# Altium schematic sheet [04] MICROCONTROLLER.SchDoc: Template
size A4; Author: Hom; CompanyName: KitSprout; DrawnBy: Hom; Engineer: Hom; Organization: KitSprout; Revision: A; SheetNumber: 4; SheetTotal: 7; Version: 0.0; LibVersion: 0.0
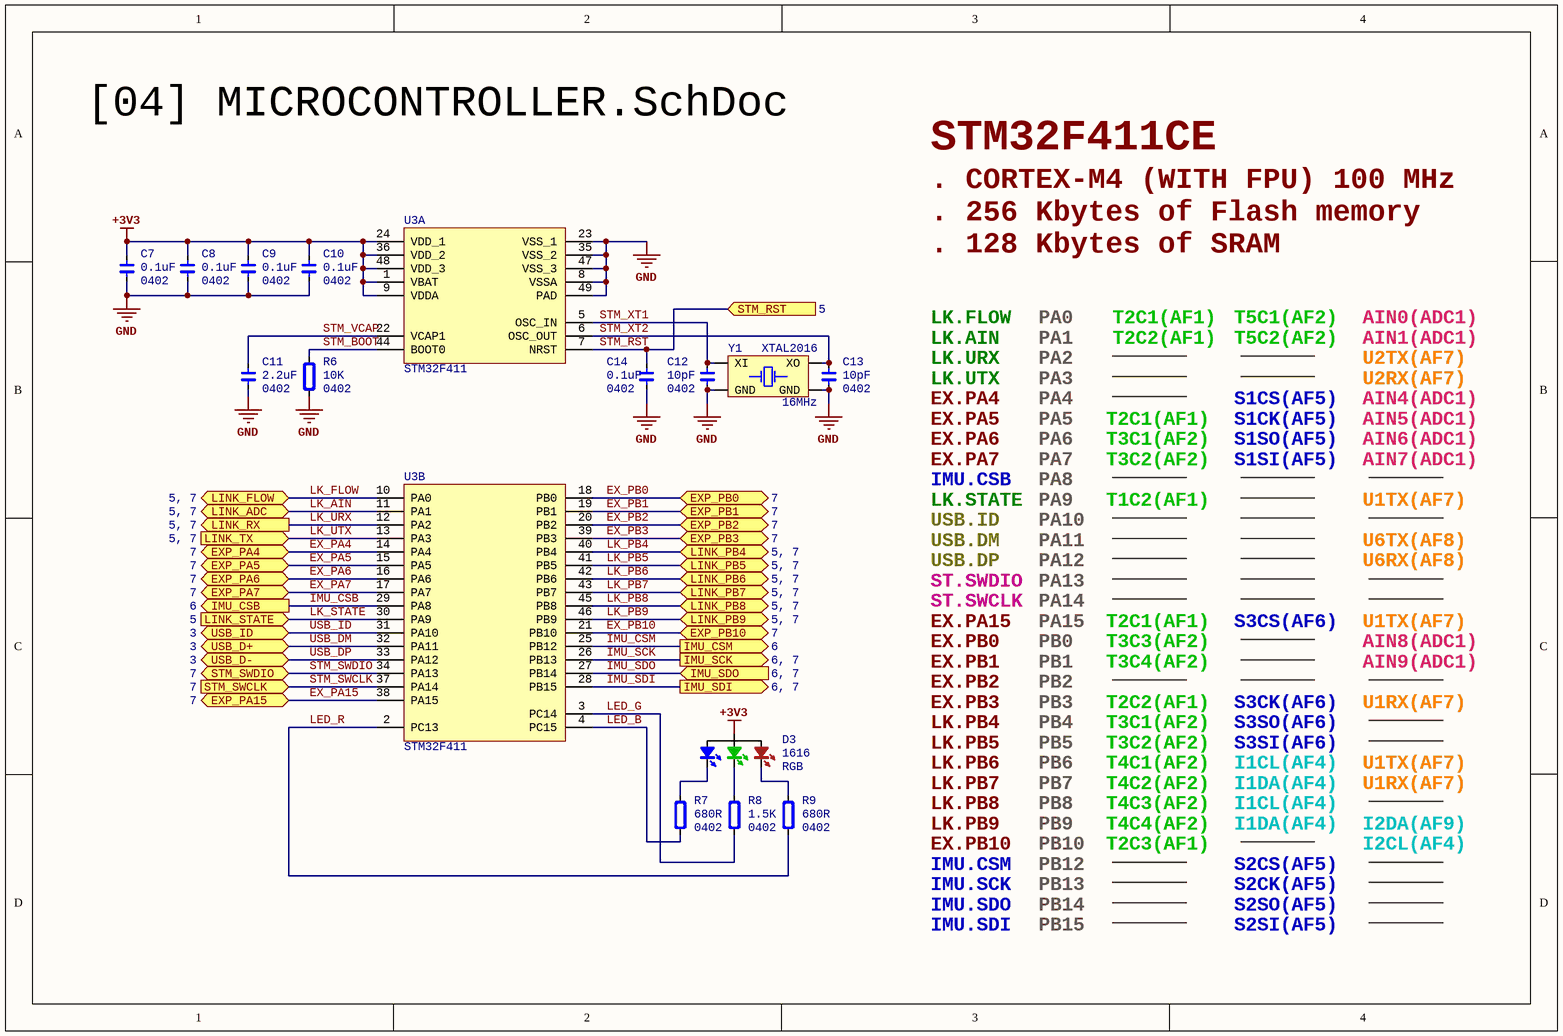
[diagram p0: [04] MICROCONTROLLER.SchDoc]

## Parts
C7  value 0.1uF  Type: 0402  [CAP_0402]  (hidden comment: C0402)
C8  value 0.1uF  Type: 0402  [CAP_0402]  (hidden comment: C0402)
C9  value 0.1uF  Type: 0402  [CAP_0402]  (hidden comment: C0402)
C10  value 0.1uF  Type: 0402  [CAP_0402]  (hidden comment: C0402)
C11  value 2.2uF  Type: 0402  [CAP_0402]  (hidden comment: C0402)
C12  value 10pF  Type: 0402  [CAP_0402]  (hidden comment: C0402)
C13  value 10pF  Type: 0402  [CAP_0402]  (hidden comment: C0402)
C14  value 0.1uF  Type: 0402  [CAP_0402]  (hidden comment: C0402)
D3  Type: 1616  [LED_1616_RGB]  (hidden comment: RGB)
R6  value 10K  Type: 0402  [RES_0402]  (hidden comment: R0402)
R7  value 680R  Type: 0402  [RES_0402]  (hidden comment: R0402)
R8  value 1.5K  Type: 0402  [RES_0402]  (hidden comment: R0402)
R9  value 680R  Type: 0402  [RES_0402]  (hidden comment: R0402)
U3  STM32F411  [QFN_P0.5_48]  (parts A,B of 2)
Y1  value 16MHz  [XT_2016_4]  (hidden comment: XTAL2016)

## Ports
EXP_PA4 (bidir, see 7), EXP_PA5 (bidir, see 7), EXP_PA6 (bidir, see 7), EXP_PA7 (bidir, see 7), EXP_PA15 (bidir, see 7), EXP_PB0 (bidir, see 7), EXP_PB1 (bidir, see 7), EXP_PB2 (bidir, see 7), EXP_PB3 (bidir, see 7), EXP_PB10 (bidir, see 7), IMU_CSB (out, see 6), IMU_CSM (out, see 6), IMU_SCK (out, see 6, 7), IMU_SDI (out, see 6, 7), IMU_SDO (in, see 6, 7), LINK_ADC (bidir, see 5, 7), LINK_FLOW (bidir, see 5, 7), LINK_PB4 (bidir, see 5, 7), LINK_PB5 (bidir, see 5, 7), LINK_PB6 (bidir, see 5, 7), LINK_PB7 (bidir, see 5, 7), LINK_PB8 (bidir, see 5, 7), LINK_PB9 (bidir, see 5, 7), LINK_RX (out, see 5, 7), LINK_STATE (in, see 5), LINK_TX (in, see 5, 7), STM_RST (in, see 5), STM_SWCLK (in, see 7), STM_SWDIO (bidir, see 7), USB_D+ (bidir, see 3), USB_D- (bidir, see 3), USB_ID (bidir, see 3)

## Nets
+3V3: C7.2 C8.2 C9.2 C10.2 D3.4(A) U3.1(VBAT) U3.9(VDDA) U3.24(VDD_1) U3.36(VDD_2) U3.48(VDD_3)
GND: C7.1 C8.1 C9.1 C10.1 C11.1 C12.1 C13.1 C14.1 R6.1 U3.8(VSSA) U3.23(VSS_1) U3.35(VSS_2) U3.47(VSS_3) U3.49(PAD) Y1.2(GND) Y1.4(GND)
EX_PA4: U3.14(PA4) ; port EXP_PA4
EX_PA5: U3.15(PA5) ; port EXP_PA5
EX_PA6: U3.16(PA6) ; port EXP_PA6
EX_PA7: U3.17(PA7) ; port EXP_PA7
EX_PA15: U3.38(PA15) ; port EXP_PA15
EX_PB0: U3.18(PB0) ; port EXP_PB0
EX_PB1: U3.19(PB1) ; port EXP_PB1
EX_PB2: U3.20(PB2) ; port EXP_PB2
EX_PB3: U3.39(PB3) ; port EXP_PB3
EX_PB10: U3.21(PB10) ; port EXP_PB10
IMU_CSB: U3.29(PA8) ; port IMU_CSB
IMU_CSM: U3.25(PB12) ; port IMU_CSM
IMU_SCK: U3.26(PB13) ; port IMU_SCK
IMU_SDI: U3.28(PB15) ; port IMU_SDI
IMU_SDO: U3.27(PB14) ; port IMU_SDO
LED_B: R7.1 U3.4(PC15)
LED_G: R8.1 U3.3(PC14)
LED_R: R9.1 U3.2(PC13)
LK_AIN: U3.11(PA1) ; port LINK_ADC
LK_FLOW: U3.10(PA0) ; port LINK_FLOW
LK_PB4: U3.40(PB4) ; port LINK_PB4
LK_PB5: U3.41(PB5) ; port LINK_PB5
LK_PB6: U3.42(PB6) ; port LINK_PB6
LK_PB7: U3.43(PB7) ; port LINK_PB7
LK_PB8: U3.45(PB8) ; port LINK_PB8
LK_PB9: U3.46(PB9) ; port LINK_PB9
LK_STATE: U3.30(PA9) ; port LINK_STATE
LK_URX: U3.12(PA2) ; port LINK_RX
LK_UTX: U3.13(PA3) ; port LINK_TX
STM_BOOT: R6.2 U3.44(BOOT0)
STM_RST: C14.2 U3.7(NRST) ; port STM_RST
STM_SWCLK: U3.37(PA14) ; port STM_SWCLK
STM_SWDIO: U3.34(PA13) ; port STM_SWDIO
STM_VCAP: C11.2 U3.22(VCAP1)
STM_XT1: C12.2 U3.5(OSC_IN) Y1.1(XI)
STM_XT2: C13.2 U3.6(OSC_OUT) Y1.3(XO)
USB_DM: U3.32(PA11) ; port USB_D+
USB_DP: U3.33(PA12) ; port USB_D-
USB_ID: U3.31(PA10) ; port USB_ID
NetD3_1: D3.1(R) R9.2
NetD3_2: D3.2(G) R8.2
NetD3_3: D3.3(B) R7.2

## Notes on the sheet
- STM32F411CE
- . CORTEX-M4 (WITH FPU) 100 MHz
  . 256 Kbytes of Flash memory
  . 128 Kbytes of SRAM
- LK.FLOW
- LK.AIN
- LK.URX
- LK.UTX
- PA0
- PA1
- PA2
- PA3
- T2C1(AF1)
- T2C2(AF1)
- T5C1(AF2)
- T5C2(AF2)
- AIN0(ADC1)
- AIN1(ADC1)
- U2TX(AF7)
- U2RX(AF7)
- EX.PA4
- EX.PA5
- EX.PA6
- PA4
- PA5
- PA6
- T3C1(AF2)
- S1CS(AF5)
- S1CK(AF5)
- S1SO(AF5)
- AIN4(ADC1)
- AIN5(ADC1)
- AIN6(ADC1)
- EX.PA7
- IMU.CSB
- LK.STATE
- PA7
- PA8
- PA9
- T3C2(AF2)
- T1C2(AF1)
- S1SI(AF5)
- AIN7(ADC1)
- U1TX(AF7)
- USB.ID
- USB.DM
- USB.DP
- PA10
- PA11
- PA12
- U6TX(AF8)
- U6RX(AF8)
- EX.PA15
- EX.PB0
- ST.SWDIO
- ST.SWCLK
- PA15
- PB0
- PA13
- PA14
- T3C3(AF2)
- S3CS(AF6)
- AIN8(ADC1)
- EX.PB1
- EX.PB3
- EX.PB2
- PB1
- PB3
- PB2
- T3C4(AF2)
- S3CK(AF6)
- AIN9(ADC1)
- U1RX(AF7)
- LK.PB4
- LK.PB5
- LK.PB6
- LK.PB7
- PB4
- PB5
- PB6
- PB7
- T4C1(AF2)
- T4C2(AF2)
- I1CL(AF4)
- I1DA(AF4)
- S3SO(AF6)
- S3SI(AF6)
- LK.PB8
- LK.PB9
- EX.PB10
- PB8
- PB9
- PB10
- T4C3(AF2)
- T4C4(AF2)
- T2C3(AF1)
- I2CL(AF4)
- I2DA(AF9)
- IMU.CSM
- IMU.SCK
- IMU.SDO
- PB12
- PB13
- PB14
- S2CS(AF5)
- S2CK(AF5)
- S2SO(AF5)
- IMU.SDI
- PB15
- S2SI(AF5)

## Library data of the parts
C7-C14 = Cap_0402: Capacitor; Specification: X7R 50V; Manufacturer: *
D3 = LED_1616_RGB: LED; Value: RGB
R6-R9 = Res_0402: Resistor; Specification: ±5%; Manufacturer: *
U3 = STM32F4x1C: MCU; Value: 100MHz; Type: QFN48 P0.5
Y1 = XTAL_2016_4P: Crystal Oscillator; Type: XTAL2016